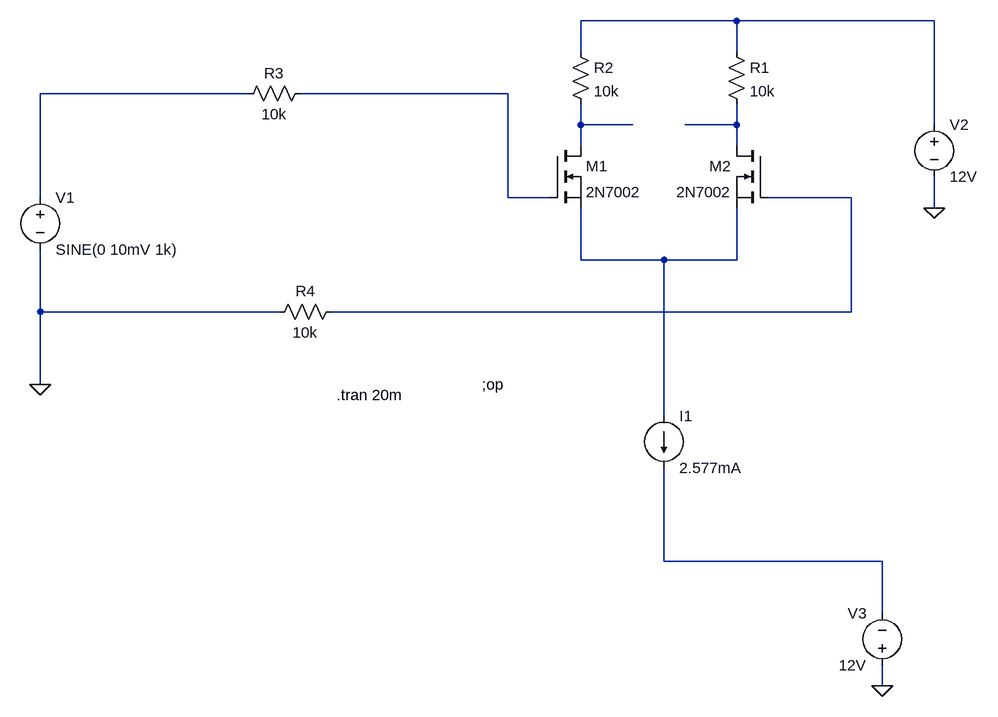
[diagram p0: schematic 差分放大器.asc]
差分放大器.asc, the LTspice schematic file:
Version 4
SHEET 1 932 964
WIRE 320 -80 80 -80
WIRE 624 -80 320 -80
WIRE 80 -32 80 -80
WIRE 320 -32 320 -80
WIRE -432 32 -752 32
WIRE -32 32 -352 32
WIRE 80 80 80 48
WIRE 160 80 80 80
WIRE 320 80 320 48
WIRE 320 80 240 80
WIRE 624 80 624 -80
WIRE 80 112 80 80
WIRE 320 112 320 80
WIRE -752 192 -752 32
WIRE -32 192 -32 32
WIRE 32 192 -32 192
WIRE 496 192 368 192
WIRE 624 208 624 160
WIRE 80 288 80 208
WIRE 208 288 80 288
WIRE 320 288 320 208
WIRE 320 288 208 288
WIRE -752 368 -752 272
WIRE -384 368 -752 368
WIRE 496 368 496 192
WIRE 496 368 -304 368
WIRE -752 480 -752 368
WIRE 208 528 208 288
WIRE 208 752 208 608
WIRE 544 752 208 752
WIRE 544 832 544 752
WIRE 544 944 544 912
FLAG 624 208 0
FLAG -752 480 0
FLAG 544 944 0
SYMBOL nmos 32 112 R0
SYMATTR InstName M1
SYMATTR Value 2N7002
SYMBOL res 304 -48 R0
SYMATTR InstName R1
SYMATTR Value 10k
SYMBOL res 64 -48 R0
SYMATTR InstName R2
SYMATTR Value 10k
SYMBOL res -448 48 R270
WINDOW 0 32 56 VTop 2
WINDOW 3 0 56 VBottom 2
SYMATTR InstName R3
SYMATTR Value 10k
SYMBOL res -288 352 R90
WINDOW 0 0 56 VBottom 2
WINDOW 3 32 56 VTop 2
SYMATTR InstName R4
SYMATTR Value 10k
SYMBOL voltage -752 176 R0
SYMATTR InstName V1
SYMATTR Value SINE(0 10mV 1k)
SYMBOL voltage 624 64 R0
WINDOW 123 0 0 Left 0
WINDOW 39 0 0 Left 0
SYMATTR InstName V2
SYMATTR Value 12V
SYMBOL current 208 528 R0
WINDOW 123 0 0 Left 0
WINDOW 39 0 0 Left 0
SYMATTR InstName I1
SYMATTR Value 2.577mA
SYMBOL voltage 544 928 R180
WINDOW 0 24 96 Left 2
WINDOW 3 24 16 Left 2
WINDOW 123 0 0 Left 0
WINDOW 39 0 0 Left 0
SYMATTR InstName V3
SYMATTR Value 12V
SYMBOL nmos 368 112 M0
SYMATTR InstName M2
SYMATTR Value 2N7002
TEXT -72 480 Left 2 !;op
TEXT -296 496 Left 2 !.tran 20m

The netlist it stands for:
* 差分放大器.asc
M1 N004 N003 N007 N007 2N7002
R1 N001 N005 10k
R2 N001 N004 10k
R3 N002 N003 10k
R4 N006 0 10k
V1 N002 0 SINE(0 10mV 1k)
V2 N001 0 12V
I1 N007 N008 2.577mA
V3 0 N008 12V
M2 N005 N006 N007 N007 2N7002
.model NMOS NMOS
.model PMOS PMOS
.lib standard.mos
;op
.tran 20m
.backanno
.end